# Altium schematic sheet TempEnhanced.SchDoc
size 558 x 431 mm; SheetNumber: 4; SheetTotal: 8
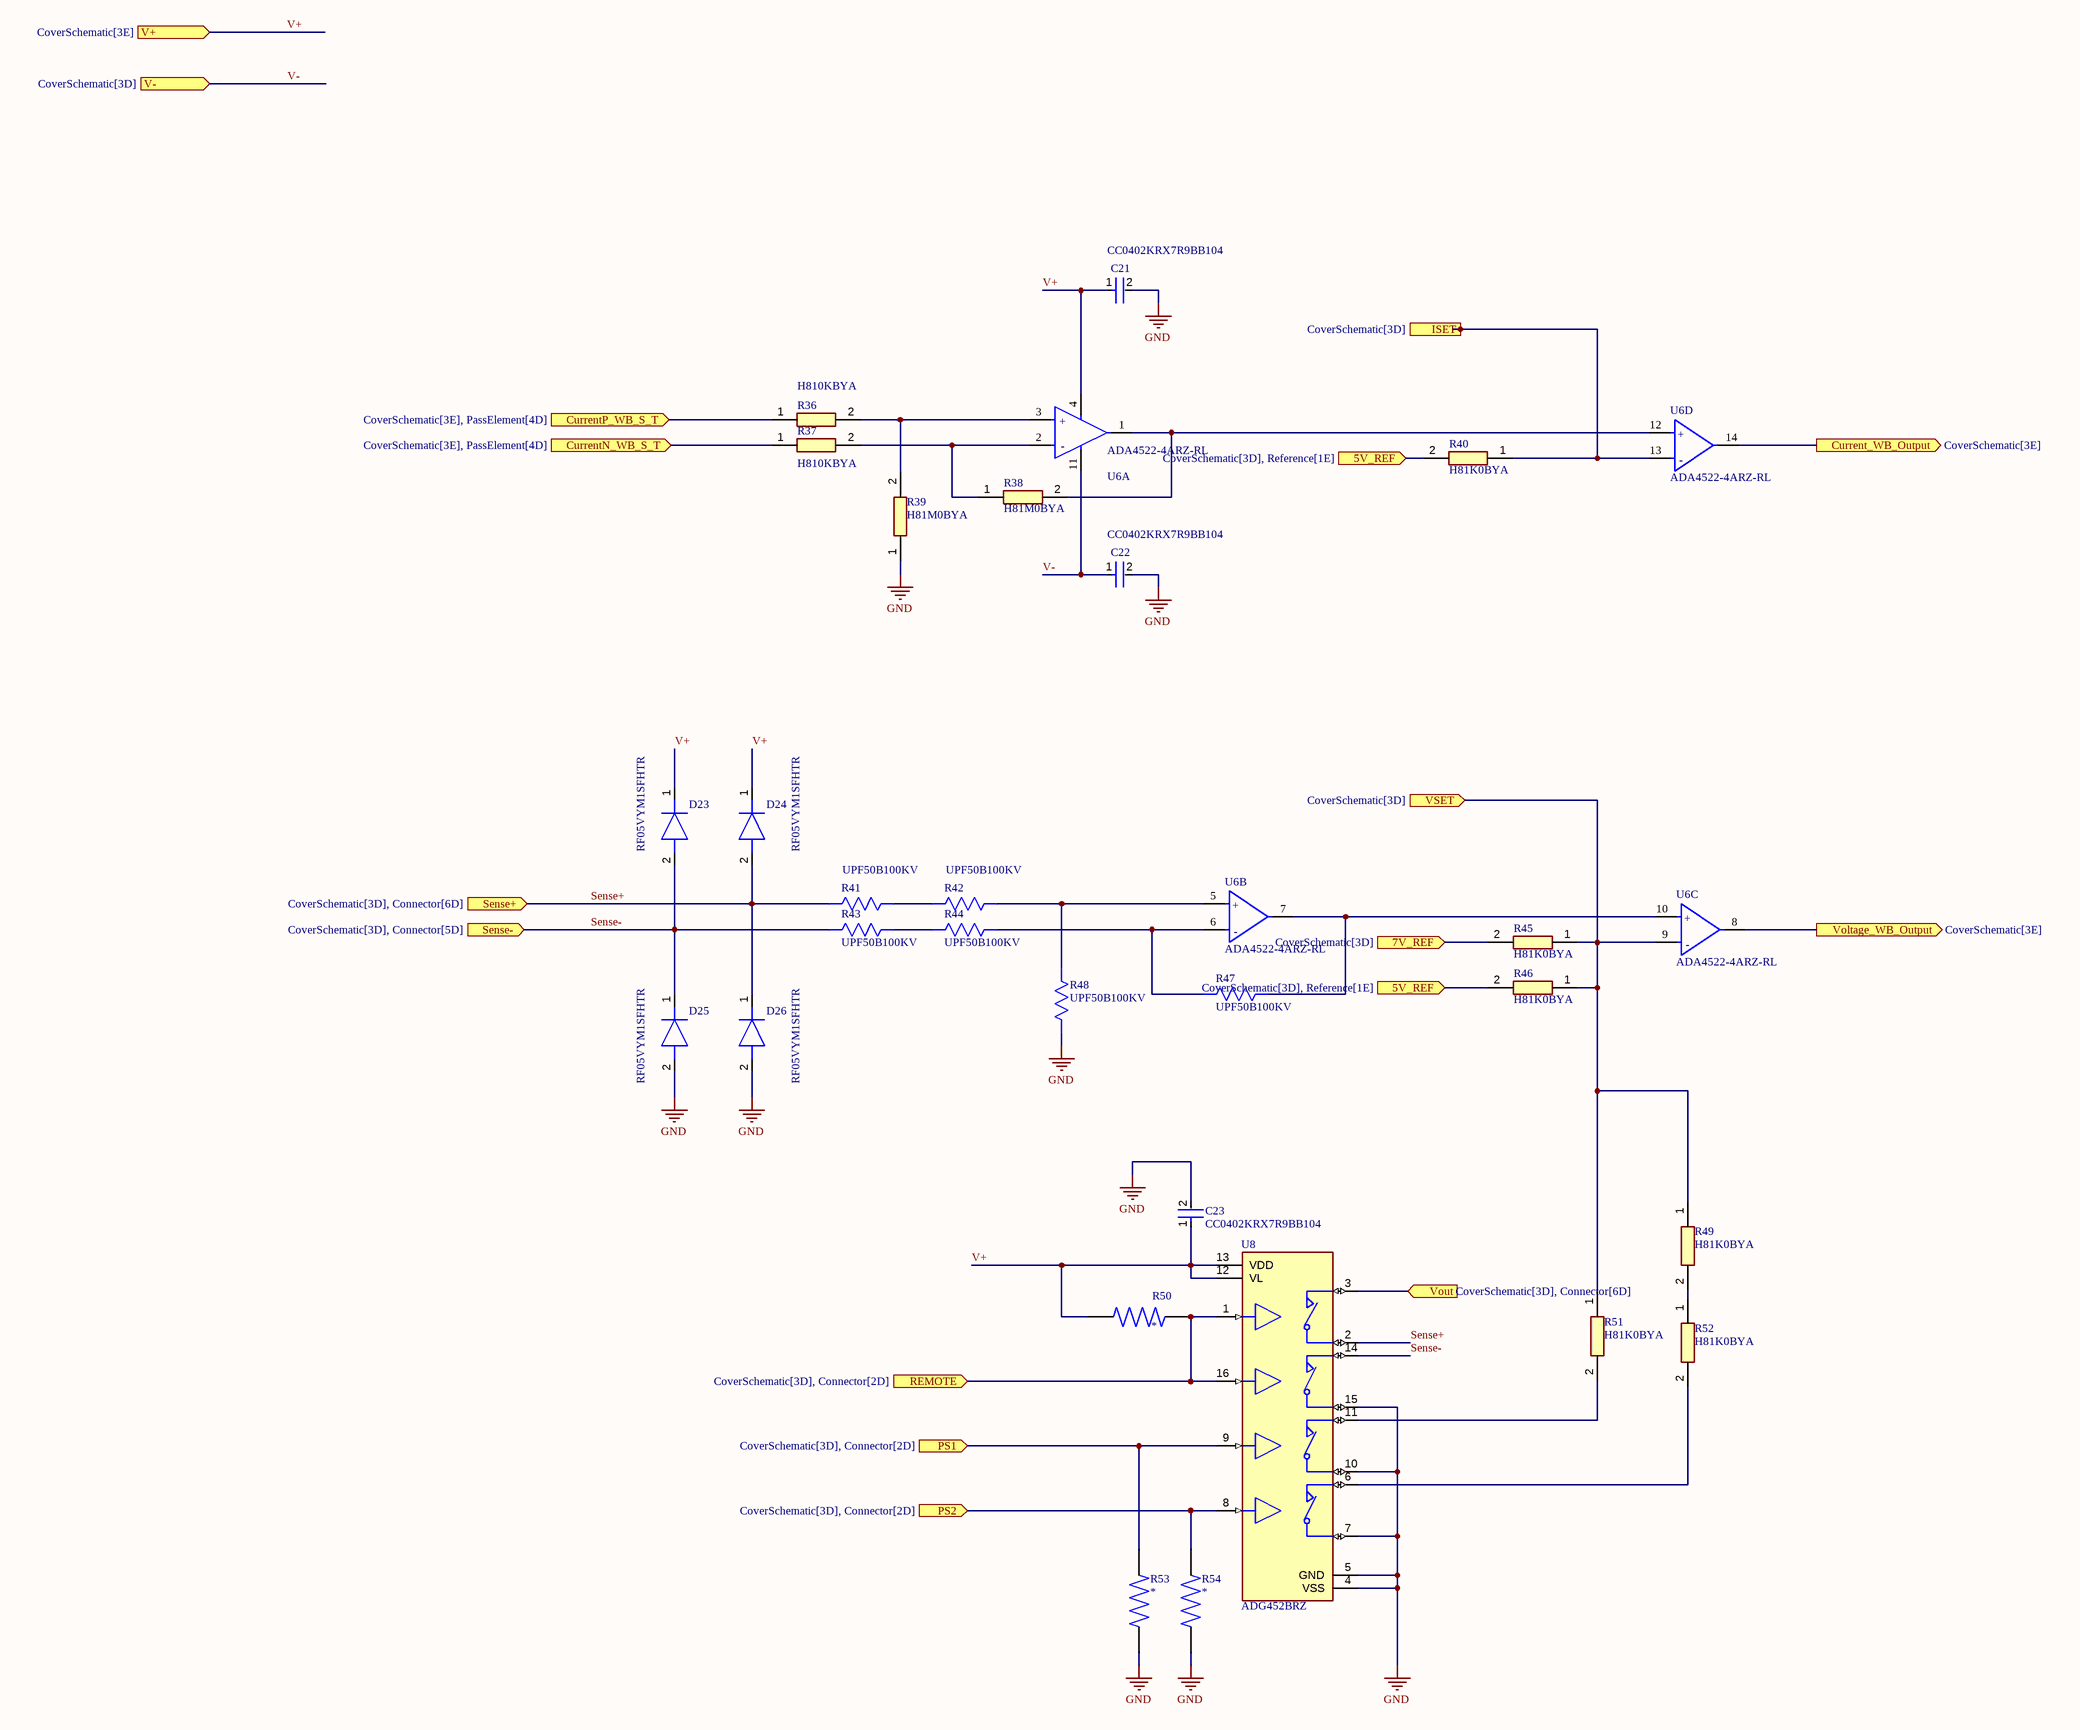
[diagram p0: TempEnhanced.SchDoc]

## Parts
C21  CC0402KRX7R9BB104  [FP-CC0402-MFG]
C22  CC0402KRX7R9BB104  [FP-CC0402-MFG]
C23  CC0402KRX7R9BB104  [FP-CC0402-MFG]
D23  RF05VYM1SFHTR  [RF05VYM1SFHTR]
D24  RF05VYM1SFHTR  [RF05VYM1SFHTR]
D25  RF05VYM1SFHTR  [RF05VYM1SFHTR]
D26  RF05VYM1SFHTR  [RF05VYM1SFHTR]
R36  H810KBYA  [RESAD1690W60L710D245]
R37  H810KBYA  [RESAD1690W60L710D245]
R38  H81M0BYA  [RESAD1690W60L710D245]
R39  H81M0BYA  [RESAD1690W60L710D245]
R40  H81K0BYA  [RESAD1690W60L710D245]
R41  UPF50B100KV  [RES_UPF50B2K0V_TEC]
R42  UPF50B100KV  [RES_UPF50B2K0V_TEC]
R43  UPF50B100KV  [RES_UPF50B2K0V_TEC]
R44  UPF50B100KV  [RES_UPF50B2K0V_TEC]
R45  H81K0BYA  [RESAD1690W60L710D245]
R46  H81K0BYA  [RESAD1690W60L710D245]
R47  UPF50B100KV  [RES_UPF50B2K0V_TEC]
R48  UPF50B100KV  [RES_UPF50B2K0V_TEC]
R49  H81K0BYA  [RESAD1690W60L710D245]
R50  MCT06030C1001FP500  [RESC1508X55N]  (value not drawn)
R51  H81K0BYA  [RESAD1690W60L710D245]
R52  H81K0BYA  [RESAD1690W60L710D245]
R53  MCT06030C1001FP500  [RESC1508X55N]  (value not drawn)
R54  MCT06030C1001FP500  [RESC1508X55N]  (value not drawn)
U6  ADA4522-4ARZ-RL  [FP-R-14-IPC_C]  (parts A,B,C,D of 4)
U8  ADG452BRZ  [FP-R-16-IPC_B]

## Ports
5V_REF (in, see CoverSchematic[3D], Reference[1E]), 7V_REF (in, see CoverSchematic[3D]), Current_WB_Output (out, see CoverSchematic[3E]), CurrentN_WB_S_T (in, see CoverSchematic[3E], PassElement[4D]), CurrentP_WB_S_T (in, see CoverSchematic[3E], PassElement[4D]), ISET (in, see CoverSchematic[3D]), PS1 (in, see CoverSchematic[3D], Connector[2D]), PS2 (in, see CoverSchematic[3D], Connector[2D]), REMOTE (in, see CoverSchematic[3D], Connector[2D]), Sense+ (in, see CoverSchematic[3D], Connector[6D]), Sense- (in, see CoverSchematic[3D], Connector[5D]), V+ (in, see CoverSchematic[3E]), V- (in, see CoverSchematic[3D]), Voltage_WB_Output (out, see CoverSchematic[3E]), Vout (in, see CoverSchematic[3D], Connector[6D]), VSET (in, see CoverSchematic[3D])

## Nets
GND: C21.2 C22.2 C23.2 D25.2(A) D26.2(A) R39.1 R48.2 R53.1 R54.1 U8.4(VSS) U8.5(GND) U8.7(D4) U8.10(D3) U8.15(D2)
5V_REF: R40.2 R46.2 ; port 5V_REF
7V_REF: R45.2 ; port 7V_REF
Current_WB_Output: U6.14(OUT_D) ; port Current_WB_Output
CurrentN_WB_S_T: R37.1 ; port CurrentN_WB_S_T
CurrentP_WB_S_T: R36.1 ; port CurrentP_WB_S_T
ISET: R40.1 U6.13(-IN_D) ; port ISET
PS1: R53.2 U8.9(IN3) ; port PS1
PS2: R54.2 U8.8(IN4) ; port PS2
REMOTE: R50.2 U8.1(IN1) U8.16(IN2) ; port REMOTE
Sense+: D24.2(A) D26.1(K) R41.2 U8.2(D1) ; port Sense+
Sense-: D23.2(A) D25.1(K) R43.2 U8.14(S2) ; port Sense-
V+: C21.1 C23.1 D23.1(K) D24.1(K) R50.1 U6.4(V+) U8.12(VL) U8.13(VDD) ; port V+
V-: C22.1 U6.11(V-) ; port V-
Voltage_WB_Output: U6.8(OUT_C) ; port Voltage_WB_Output
Vout: U8.3(S1) ; port Vout
VSET: R45.1 R46.1 R49.1 R51.1 U6.9(-IN_C) ; port VSET
NetR36_2: R36.2 R39.2 U6.3(+IN_A)
NetR37_2: R37.2 R38.1 U6.2(-IN_A)
NetR38_2: R38.2 U6.1(OUT_A) U6.12(+IN_D)
NetR41_1: R41.1 R42.2
NetR42_1: R42.1 R48.1 U6.5(+IN_B)
NetR43_1: R43.1 R44.2
NetR44_1: R44.1 R47.2 U6.6(-IN_B)
NetR47_1: R47.1 U6.7(OUT_B) U6.10(+IN_C)
NetR49_2: R49.2 R52.1
NetR51_2: R51.2 U8.11(S3)
NetR52_2: R52.2 U8.6(S4)

## Notes on the sheet
- DWG. NO.
- REV.
- SHT.
- REVISION
- DESCRIPTION
- DATE
- APPROVED
- THIS DOCUMENT AND THE DATA DISCLOSED HEREIN OR HEREWITH IS THE PROPERTY OF ALTIUM LIMITED AND MAY BE FREELY DISTRIBUTED IN WHOLE. NO RIGHTS ARE RESERVED OR EXPRESS OR IMPLIED WARANTEE GIVEN.
- PROJECT
- TITLE
- SCALE:
- C
- SIZE
- CAGE CODE
- FILE NAME
- DWG by:
- Heitor Sampaio Mendes
- SHEET
- OF
- REV
- (in symbol CMP-09116-000280-1, part A) +; -
- (in symbol CMP-09116-000280-1, part B) +; -
- (in symbol CMP-09116-000280-1, part C) +; -
- (in symbol CMP-09116-000280-1, part D) +; -

## Library data of the parts
C21-C23 = CMP-03422-001010-1: CAP CER 0.1UF 50V X7R 0402; Manufacturer: YAGEO; Capacitance: 100 nF; Temperature Coefficient: 30ppm/°C; Material: Ceramic; Value: 100 nF; Automotive Grade: NA; Tolerance: 0.1; Footprint Url: http://www.yageo.com/exep/pages/download/literatures/UPY-C_GEN_24.pdf; Category: Cap; Package: CC0402; Voltage Rating: 50 V; ComponentLink2Description: Datasheet; Temperature Characteristic: X7R; Device Class L1: Passive Components; Device Class L2: Capacitors; Digikey Description: CAP CER 0.1UF 50V X7R 0402; Octopart: https://octopart.com/cc0402krx7r9bb104-yageo-56536067; Device Class L3: Ceramic Capacitors; Height: 0.55mm; Temperature: -55°C to +125°C; Temperature Range High: +125°C; ComponentLink2URL: http://www.yageo.com/documents/recent/UPY-GP_NP0_16V-to-50V_16.pdf; Temperature Range Low: -55°C; RoHS: TRUE; Ipc Land Pattern Name: CAPC10050X50; Lead Free: Yes; Automotive: No; Manufacturer Part Number: CC0402KRX7R9BB104
D23-D26 = RF05VYM1SFHTR: Diode; Manufacturer_Name: ROHM Semiconductor; Datasheet Link: https://fscdn.rohm.com/en/products/databook/datasheet/discrete/diode/fast_recovery/rf05vym1sfh.pdf; Height: 0.8mm; Manufacturer_Part_Number: RF05VYM1SFHTR; Mouser Part Number: 755-RF05VYM1SFHTR; Mouser Price/Stock: https://www.mouser.co.uk/ProductDetail/ROHM-Semiconductor/RF05VYM1SFHTR?qs=4v%252BiZTmLVHEBI5apodawUw%3D%3D
R36-R40 R45 R46 R49 R51 R52 = H810KBYA: Resistor; Manufacturer_Name: TE Connectivity; Datasheet Link: https://datasheet.datasheetarchive.com/originals/distributors/DKDS-21/401710.pdf; Manufacturer_Part_Number: H810KBYA; Mouser Part Number: 279-H810KBYA; Mouser Price/Stock: https://www.mouser.com/Search/Refine.aspx?Keyword=279-H810KBYA; Arrow Part Number: H810KBYA; Arrow Price/Stock: https://www.arrow.com/en/products/h810kbya/te-connectivity
R41-R44 R47 R48 = UPF50B100RV: No Description Available; Mfr_Name: TE Connectivity
R50 R53 R54 = MCT06030C1001FP500: Res Thin Film 0603 1K Ohm 1% 0.1W(1/10W) ?50ppm/C Molded SMD Automotive Medical T/R; MF: {'manufacturer': u'Vishay Beyschlag'}; Value: *; Package: None; Price: None; MP: MCT06030C1001FP500; Availability: Unavailable
U6 = CMP-09116-000280-1: IC OPAMP ZERO-DRIFT 4CIRC 14SOIC; Min Supply Voltage: 4.5V; Operating Supply Current: 830uA; Input Bias Current: 50pA; Number of Circuits: 4; Common Mode Rejection Ratio: 140dB; Output Current per Channel: 32mA; Slew Rate: 1.7V/µs; Power Supply Rejection Ratio (PSRR): 150dB; Input Offset Voltage (Vos): 1.5uV; Min Dual Supply Voltage: 2.25V; Max Supply Voltage: 55V; Gain Bandwidth Product: 2.7MHz; Max Dual Supply Voltage: 27.5V; Voltage Gain: 137dB; Max Operating Temperature: 125°C; Number of Pins: 14; Case/Package: SOIC; RoHS Compliant: Yes; Packaging: Tape and Reel; Min Operating Temperature: -40°C; Contact Plating: Tin; Lead Free: Contains Lead; Mount: Surface Mount
U8 = CMP-09113-000001-1: IC SWITCH QUAD SPST 16SOIC; Manufacturer: Analog Devices; Standoff Height: 0.1mm; Max Junction Temp: +150°C; Nominal Supply Current: 0.0001uA; On State Resistance: 4-7Ω; Number Of Circuits: 4; Min Supply Voltage: 5V; Throw Configuration: SPST-NO; Mux Demux Ratio: 1:1; Max Supply Voltage: 12V; Device Class L3: Analog Switches; Lead Free: Yes; Manufacturer Part Number: ADG452BRZ; Device Class L2: Interface ICs; Category: IC; Temperature Range Low: -40°C; Temperature Range High: +85°C; Device Class L1: Integrated Circuits (ICs); ComponentLink2URL: https://www.analog.com/media/en/technical-documentation/data-sheets/ADG451_452_453.pdf; Footprint Url: https://www.analog.com/media/en/package-pcb-resources/package/pkg_pdf/soic_narrow-r/r_16.pdf; Octopart: https://octopart.com/adg452brz-analog+devices-512739; Automotive: No; Package: R-16; RoHS: TRUE; Digikey Description: IC SWITCH QUAD SPST 16SOIC; ComponentLink2Description: Datasheet; Height: 1.75mm; Temperature: -40°C to +85°C; Mouser Description: Analog Switch ICs LC2MOS 5 Ohm SPST